# Altium schematic sheet CAN Nodes.SchDoc: CAN NODE SCHEMATIC
size A3; CheckedBy: TIMOTHY WARNOCK; Author: TIMOTHY WARNOCK; CompanyName: CURTIN MOTORSPORT TEAM; DrawnBy: TIMOTHY WARNOCK; Engineer: TIMOTHY WARNOCK; Revision: 2; SheetNumber: 5; SheetTotal: 5; ProjectName: 2017 PERMANENT LOOM
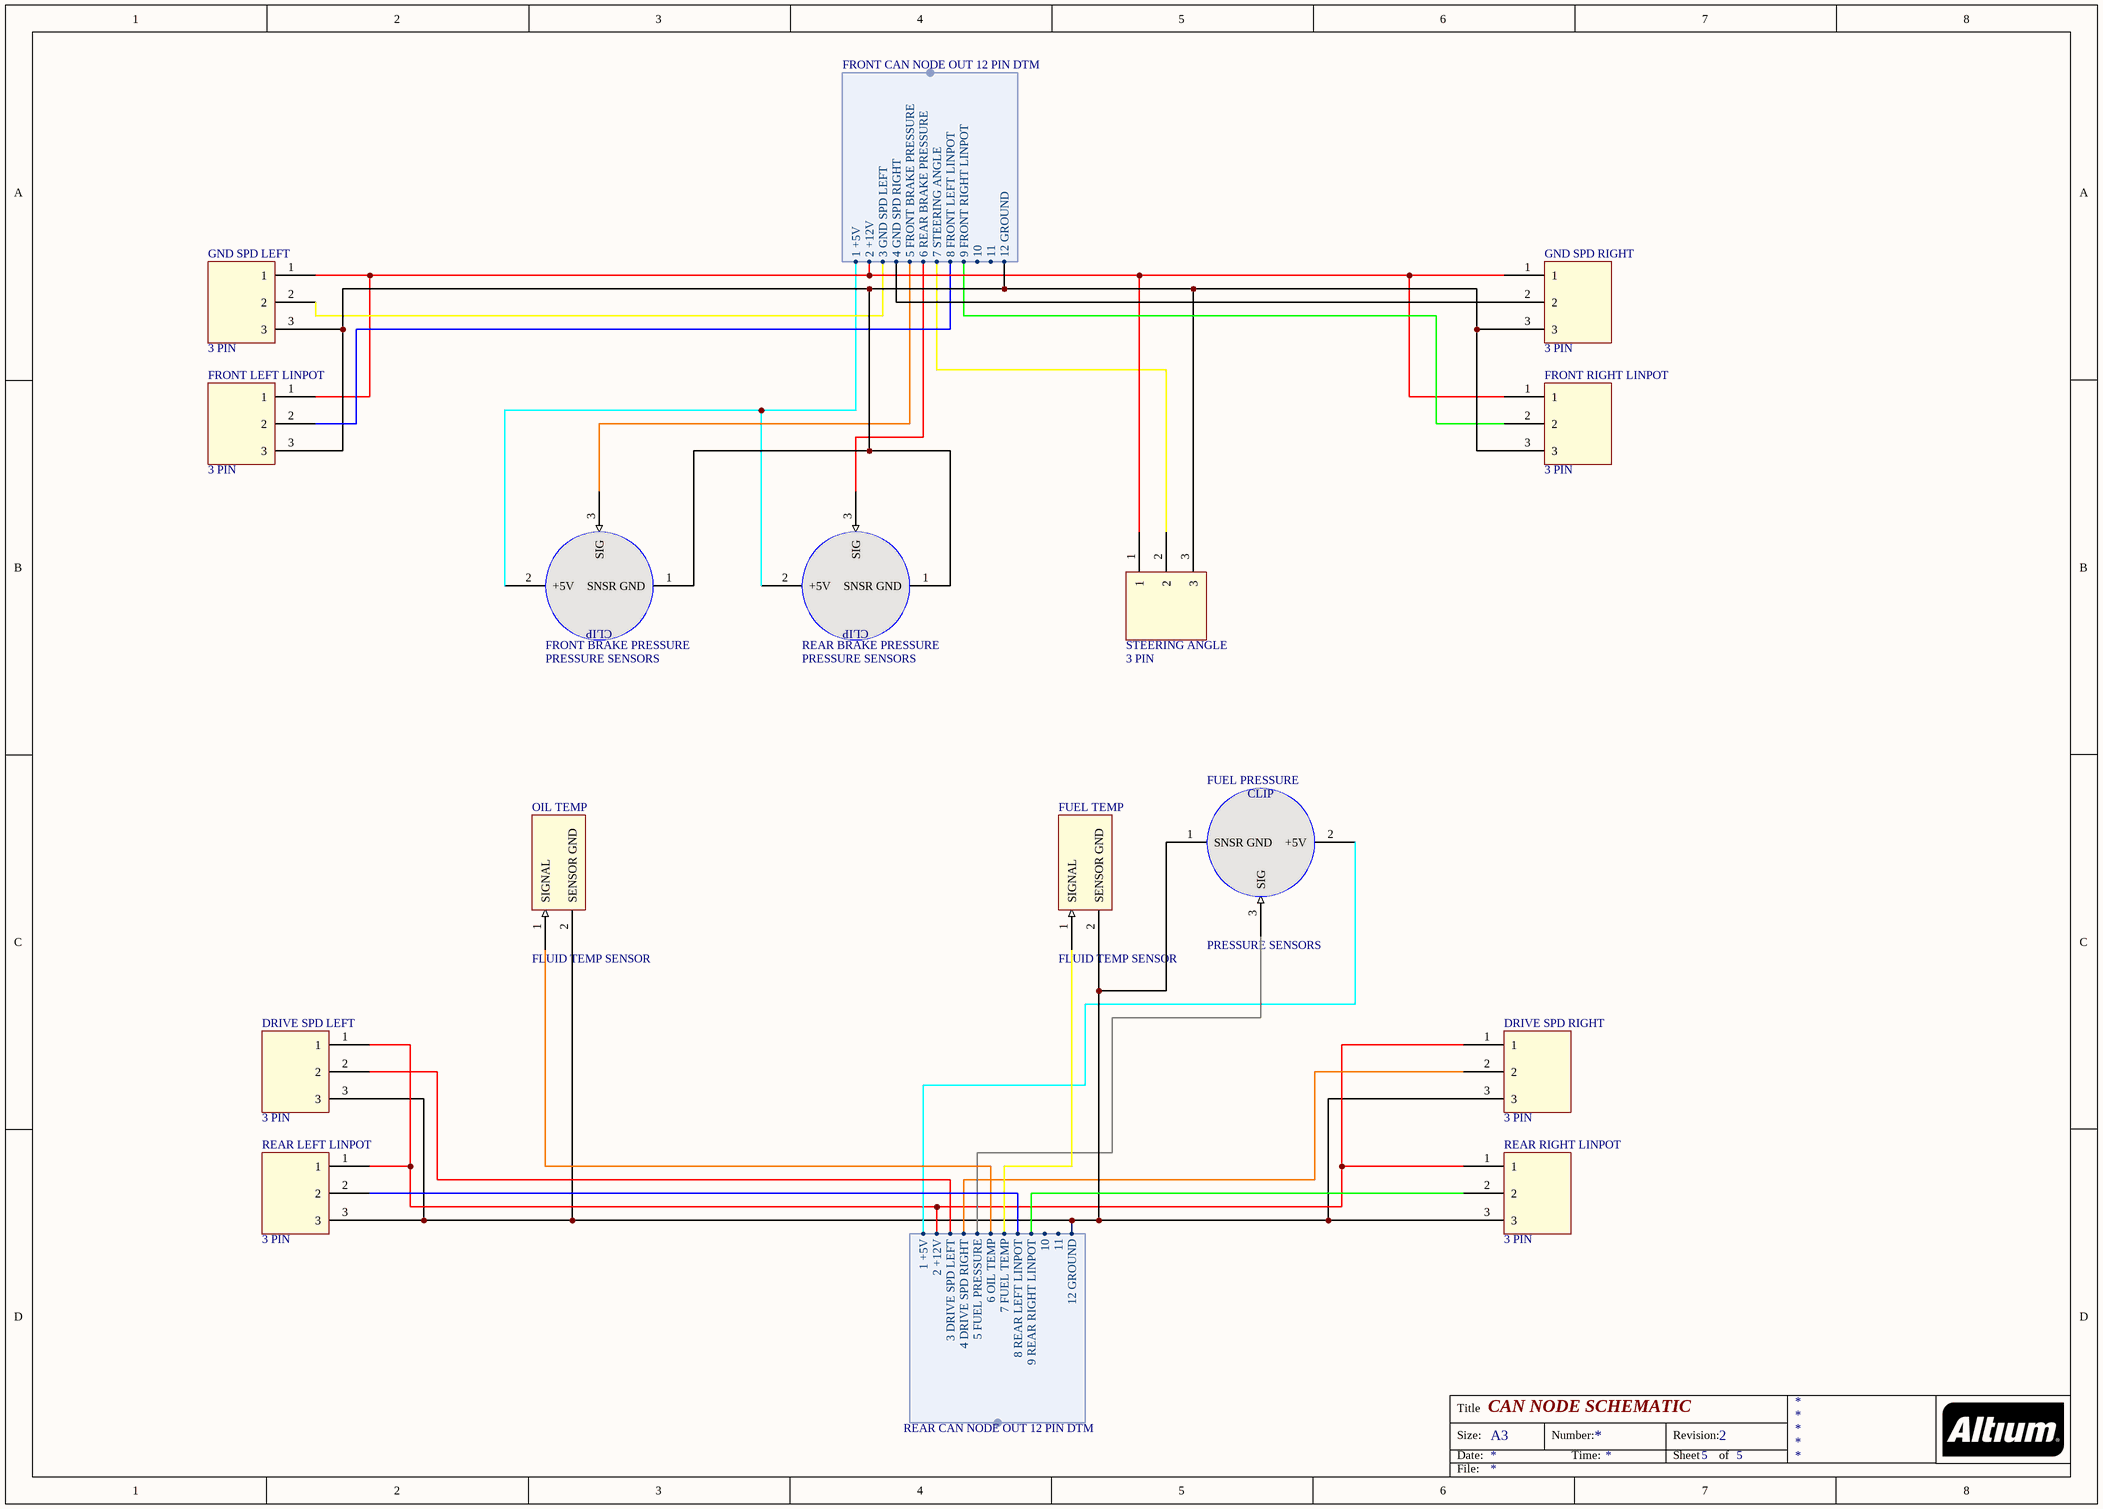
[diagram p0: CAN Nodes.SchDoc]

## Parts
DRIVE_SPD_LEFT  3 PIN
DRIVE_SPD_RIGHT  3 PIN
FRONT_BRAKE_PRESSURE  PRESSURE SENSORS
FRONT_LEFT_LINPOT  3 PIN
FRONT_RIGHT_LINPOT  3 PIN
FUEL_PRESSURE  PRESSURE SENSORS
FUEL_TEMP  FLUID TEMP SENSOR
GND_SPD_LEFT  3 PIN
GND_SPD_RIGHT  3 PIN
OIL_TEMP  FLUID TEMP SENSOR
REAR_BRAKE_PRESSURE  PRESSURE SENSORS
REAR_LEFT_LINPOT  3 PIN
REAR_RIGHT_LINPOT  3 PIN
STEERING_ANGLE  3 PIN

## Harnesses
FRONT CAN NODE OUT 12 PIN DTM: 1 +5V, 2 +12V, 3 GND SPD LEFT, 4 GND SPD RIGHT, 5 FRONT BRAKE PRESSURE, 6 REAR BRAKE PRESSURE, 7 STEERING ANGLE, 8 FRONT LEFT LINPOT, 9 FRONT RIGHT LINPOT, 10, 11, 12 GROUND
REAR CAN NODE OUT 12 PIN DTM: 1 +5V, 2 +12V, 3 DRIVE SPD LEFT, 4 DRIVE SPD RIGHT, 5 FUEL PRESSURE, 6 OIL TEMP, 7 FUEL TEMP, 8 REAR LEFT LINPOT, 9 REAR RIGHT LINPOT, 10, 11, 12 GROUND

## Nets
NetDRIVE_SPD_LEFT_1: DRIVE_SPD_LEFT.1 DRIVE_SPD_RIGHT.1 REAR_LEFT_LINPOT.1 REAR_RIGHT_LINPOT.1 ; harness REAR CAN NODE OUT 12 PIN DTM.2 +12V
NetDRIVE_SPD_LEFT_2: DRIVE_SPD_LEFT.2 ; harness REAR CAN NODE OUT 12 PIN DTM.3 DRIVE SPD LEFT
NetDRIVE_SPD_LEFT_3: DRIVE_SPD_LEFT.3 DRIVE_SPD_RIGHT.3 FUEL_PRESSURE.1(SNSR_GND) FUEL_TEMP.2(SENSOR_GND) OIL_TEMP.2(SENSOR_GND) REAR_LEFT_LINPOT.3 REAR_RIGHT_LINPOT.3 ; harness REAR CAN NODE OUT 12 PIN DTM.12 GROUND
NetDRIVE_SPD_RIGHT_2: DRIVE_SPD_RIGHT.2 ; harness REAR CAN NODE OUT 12 PIN DTM.4 DRIVE SPD RIGHT
NetFRONT_BRAKE_PRESSURE_1: FRONT_BRAKE_PRESSURE.1(SNSR_GND) FRONT_LEFT_LINPOT.3 FRONT_RIGHT_LINPOT.3 GND_SPD_LEFT.3 GND_SPD_RIGHT.3 REAR_BRAKE_PRESSURE.1(SNSR_GND) STEERING_ANGLE.3 ; harness FRONT CAN NODE OUT 12 PIN DTM.12 GROUND
NetFRONT_BRAKE_PRESSURE_2: FRONT_BRAKE_PRESSURE.2(+5V) REAR_BRAKE_PRESSURE.2(+5V) ; harness FRONT CAN NODE OUT 12 PIN DTM.1 +5V
NetFRONT_BRAKE_PRESSURE_3: FRONT_BRAKE_PRESSURE.3(SIG) ; harness FRONT CAN NODE OUT 12 PIN DTM.5 FRONT BRAKE PRESSURE
NetFRONT_LEFT_LINPOT_1: FRONT_LEFT_LINPOT.1 FRONT_RIGHT_LINPOT.1 GND_SPD_LEFT.1 GND_SPD_RIGHT.1 STEERING_ANGLE.1 ; harness FRONT CAN NODE OUT 12 PIN DTM.2 +12V
NetFRONT_LEFT_LINPOT_2: FRONT_LEFT_LINPOT.2 ; harness FRONT CAN NODE OUT 12 PIN DTM.8 FRONT LEFT LINPOT
NetFRONT_RIGHT_LINPOT_2: FRONT_RIGHT_LINPOT.2 ; harness FRONT CAN NODE OUT 12 PIN DTM.9 FRONT RIGHT LINPOT
NetFUEL_PRESSURE_2: FUEL_PRESSURE.2(+5V) ; harness REAR CAN NODE OUT 12 PIN DTM.1 +5V
NetFUEL_PRESSURE_3: FUEL_PRESSURE.3(SIG) ; harness REAR CAN NODE OUT 12 PIN DTM.5 FUEL PRESSURE
NetFUEL_TEMP_1: FUEL_TEMP.1(SIGNAL) ; harness REAR CAN NODE OUT 12 PIN DTM.7 FUEL TEMP
NetGND_SPD_LEFT_2: GND_SPD_LEFT.2 ; harness FRONT CAN NODE OUT 12 PIN DTM.3 GND SPD LEFT
NetGND_SPD_RIGHT_2: GND_SPD_RIGHT.2 ; harness FRONT CAN NODE OUT 12 PIN DTM.4 GND SPD RIGHT
NetOIL_TEMP_1: OIL_TEMP.1(SIGNAL) ; harness REAR CAN NODE OUT 12 PIN DTM.6 OIL TEMP
NetREAR_BRAKE_PRESSURE_3: REAR_BRAKE_PRESSURE.3(SIG) ; harness FRONT CAN NODE OUT 12 PIN DTM.6 REAR BRAKE PRESSURE
NetREAR_LEFT_LINPOT_2: REAR_LEFT_LINPOT.2 ; harness REAR CAN NODE OUT 12 PIN DTM.8 REAR LEFT LINPOT
NetREAR_RIGHT_LINPOT_2: REAR_RIGHT_LINPOT.2 ; harness REAR CAN NODE OUT 12 PIN DTM.9 REAR RIGHT LINPOT
NetSTEERING_ANGLE_2: STEERING_ANGLE.2 ; harness FRONT CAN NODE OUT 12 PIN DTM.7 STEERING ANGLE

## Notes on the sheet
- Title
- Size:
- Date:
- A3
- Number:
- Time:
- Revision:
- Sheet
- of
- File:
- (in symbol PRESSURE SENSORS) CLIP

## Library data of the parts
FRONT_BRAKE_PRESSURE FUEL_PRESSURE REAR_BRAKE_PRESSURE = PRESSURE SENSORS: TEXAS INSTRUMENTS 150 PSI
FUEL_TEMP OIL_TEMP = FLUID TEMP SENSOR: FOR OIL, FUEL, WATER